# EAGLE design VHN-B (EAGLE 7.1.0)
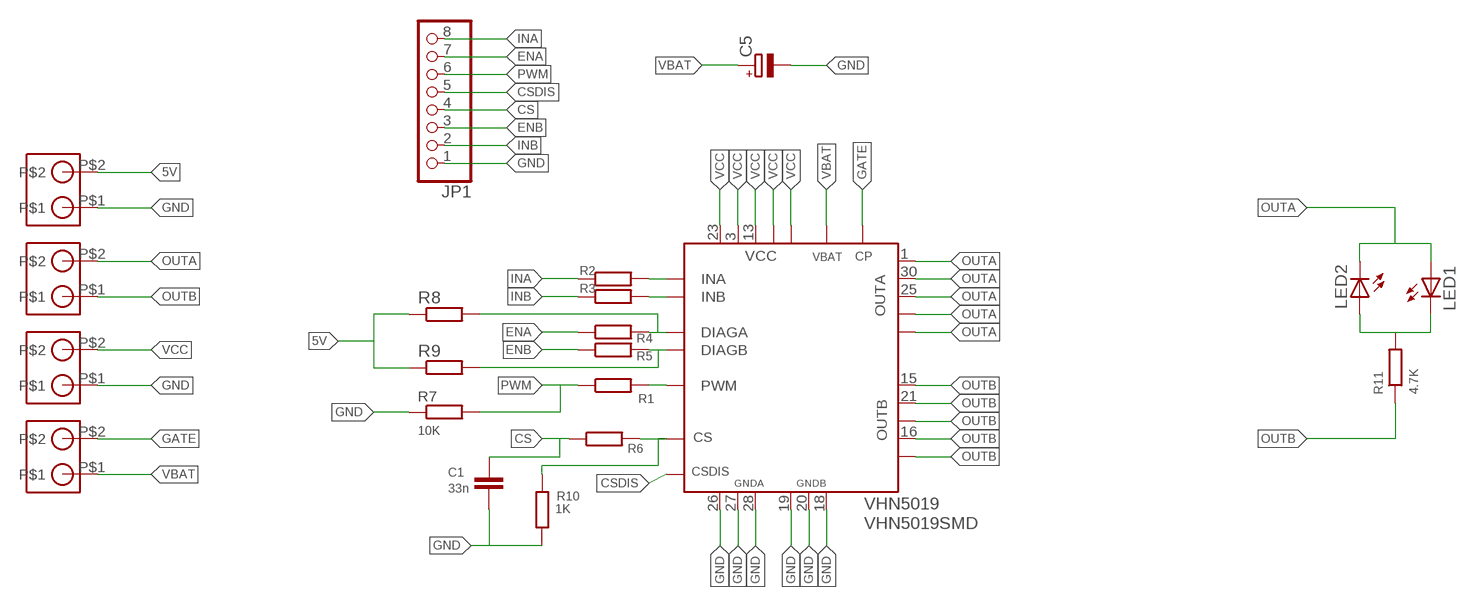
[diagram p0: schematic, sheet 1]

## Parts
C1  33n  C-EUC0402  [C0402]
C5  CPOL-EUE2,5-6E  [E2,5-6E]
JP1  PINHD-1X8  [1X08]
LED1  LEDCHIPLED_0603  [CHIPLED_0603]
LED2  LEDCHIPLED_0603  [CHIPLED_0603]
R1  R-EU_R0402  [R0402]
R2  R-EU_R0402  [R0402]
R3  R-EU_R0402  [R0402]
R4  R-EU_R0402  [R0402]
R5  R-EU_R0402  [R0402]
R6  R-EU_R0402  [R0402]
R7  10K  R-EU_R0402  [R0402]
R8  R-EU_R0402  [R0402]
R9  R-EU_R0402  [R0402]
R10  1K  R-EU_R0402  [R0402]
R11  4.7K  R-EU_R0402  [R0402]
U$1  PBCON  [02P]
U$2  PBCON  [02P]
U$3  PBCON  [02P]
U$4  PBCON  [02P]
VHN5019  VHN5019SMD  [SO-30]

## Nets
5V: R8.1 R9.1 U$4.P$2
CS: C1.1 JP1.4 R6.1
CSDIS: JP1.5 VHN5019.6(CSDIS)
ENA: JP1.7 R4.1
ENB: JP1.3 R5.1
GATE: U$3.P$2 VHN5019.11(CP)
GND: C1.2 C5.- JP1.1 R7.1 R10.1 U$1.P$1 U$4.P$1 VHN5019.18(GNDB) VHN5019.19(GNDB) VHN5019.20(GNDB) VHN5019.26(GNDA) VHN5019.27(GNDA) VHN5019.28(GNDA)
INA: JP1.8 R2.1
INB: JP1.2 R3.1
N$1: R2.2 VHN5019.4(INA)
N$2: R3.2 VHN5019.10(INB)
N$3: R4.2 R8.2 VHN5019.5(DIAGA)
N$4: R5.2 R9.2 VHN5019.9(DIAGB)
N$5: R1.2 VHN5019.7(PWM)
N$6: LED1.C LED2.A R11.2
N$7: R6.2 R10.2 VHN5019.8(CS)
OUTA: LED1.A LED2.C U$2.P$2 VHN5019.1(OUTA) VHN5019.25(OUTA) VHN5019.30(OUTA) VHN5019.OUTA VHN5019.OUTA@1(OUTA)
OUTB: R11.1 U$2.P$1 VHN5019.15(OUTB) VHN5019.16(OUTB) VHN5019.21(OUTB) VHN5019.OUTB VHN5019.OUTB@1(OUTB)
PWM: JP1.6 R1.1 R7.2
VBAT: C5.+ U$3.P$1 VHN5019.12(VBAT)
VCC: U$1.P$2 VHN5019.3(VCC) VHN5019.13(VCC) VHN5019.23(VCC) VHN5019.VCC VHN5019.VCC@1(VCC)

## Library data of the parts
C1 = rcl:C-EU: CAPACITOR, European symbol
C5 = rcl:CPOL-EU: POLARIZED CAPACITOR, European symbol
JP1 = pinhead:PINHD-1X8: PIN HEADER
LED1 LED2 = led:LED: LED OSRAM: - CHIPLED LG R971, LG N971, LY N971, LG Q971, LY Q971, LO R971, LY R971 LH N974, LH R974 LS Q976, LO Q976, LY Q976 LO Q996 - Hyper CHIPLED LW Q18S LB Q993, LB Q99A, LB R99A - SideLED LS A670, LO A670, LY A670, LG A670, LP A670 LB A673, LV A673, LT A673, LW A673 LH A674 LY A675 LS A676, LA A676, LO A676, LY A676, LW A676 LS A679, LY A679, LG A679 - Hyper Micro SIDELED® LS Y876, LA Y876, LO Y876, LY Y876 LT Y87S - SmartLED LW L88C, LW L88S LB L89C, LB L89S, LG L890 LS L89K, LO L89K, LY L89K LS L896, LA L896, LO L896, LY L896 - TOPLED LS T670, LO T670, LY T670, LG T670, LP T670 LSG T670, LSP T670, LSY T670, LOP T670, LYG T670 LG T671, LOG T671, LSG T671 LB T673, LV T673, LT T673, LW T673 LH T674 LS T676, LA T676, LO T676, LY T676, LB T676, LH T676, LSB T676, LW T676 LB T67C, LV T67C, LT T67C, LS T67K, LO T67K, LY T67K, LW E67C LS E67B, LA E67B, LO E67B, LY E67B, LB E67C, LV E67C, LT E67C LW T67C LS T679, LY T679, LG T679 LS T770, LO T770, LY T770, LG T770, LP T770 LB T773, LV T773, LT T773, LW T773 LH T774 LS E675, LA E675, LY E675, LS T675 LS T776, LA T776, LO T776, LY T776, LB T776 LHGB T686 LT T68C, LB T68C - Hyper Mini TOPLED® LB M676 - Mini TOPLED Santana® LG M470 LS M47K, LO M47K, LY M47K Source: http://www.osram.convergy.de LUXEON: - LUMILED® LXK2-PW12-R00, LXK2-PW12-S00, LXK2-PW14-U00, LXK2-PW14-V00 LXK2-PM12-R00, LXK2-PM12-S00, LXK2-PM14-U00 LXK2-PE12-Q00, LXK2-PE12-R00, LXK2-PE12-S00, LXK2-PE14-T00, LXK2-PE14-U00 LXK2-PB12-K00, LXK2-PB12-L00, LXK2-PB12-M00, LXK2-PB14-N00, LXK2-PB14-P00, LXK2-PB14-Q00 LXK2-PR12-L00, LXK2-PR12-M00, LXK2-PR14-Q00, LXK2-PR14-R00 LXK2-PD12-Q00, LXK2-PD12-R00, LXK2-PD12-S00 LXK2-PH12-R00, LXK2-PH12-S00 LXK2-PL12-P00, LXK2-PL12-Q00, LXK2-PL12-R00 Source: www.luxeon.com KINGBRIGHT: KA-3528ASYC Source: www.kingbright.com
R1-R11 = rcl:R-EU_: RESISTOR, European symbol
U$1-U$4 = 00-Custom-pbcon:PBCON
VHN5019 = VHN5019:VHN5019

## Board
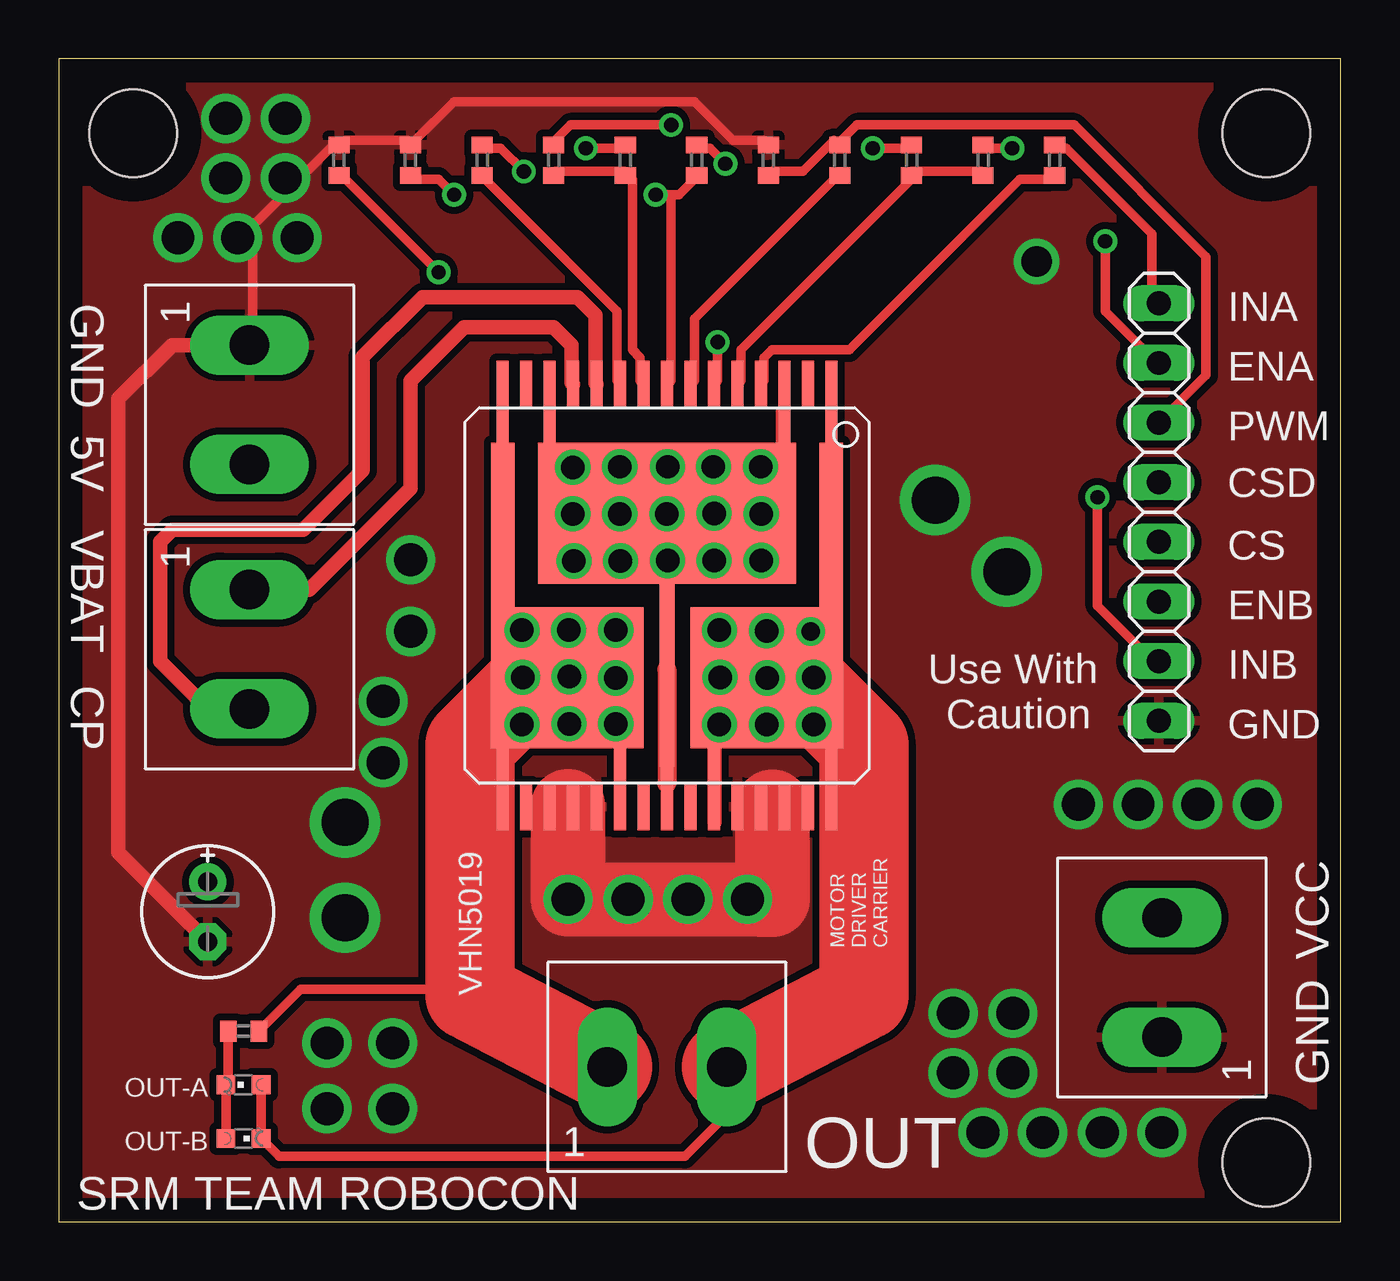
[diagram p1: board, top side]
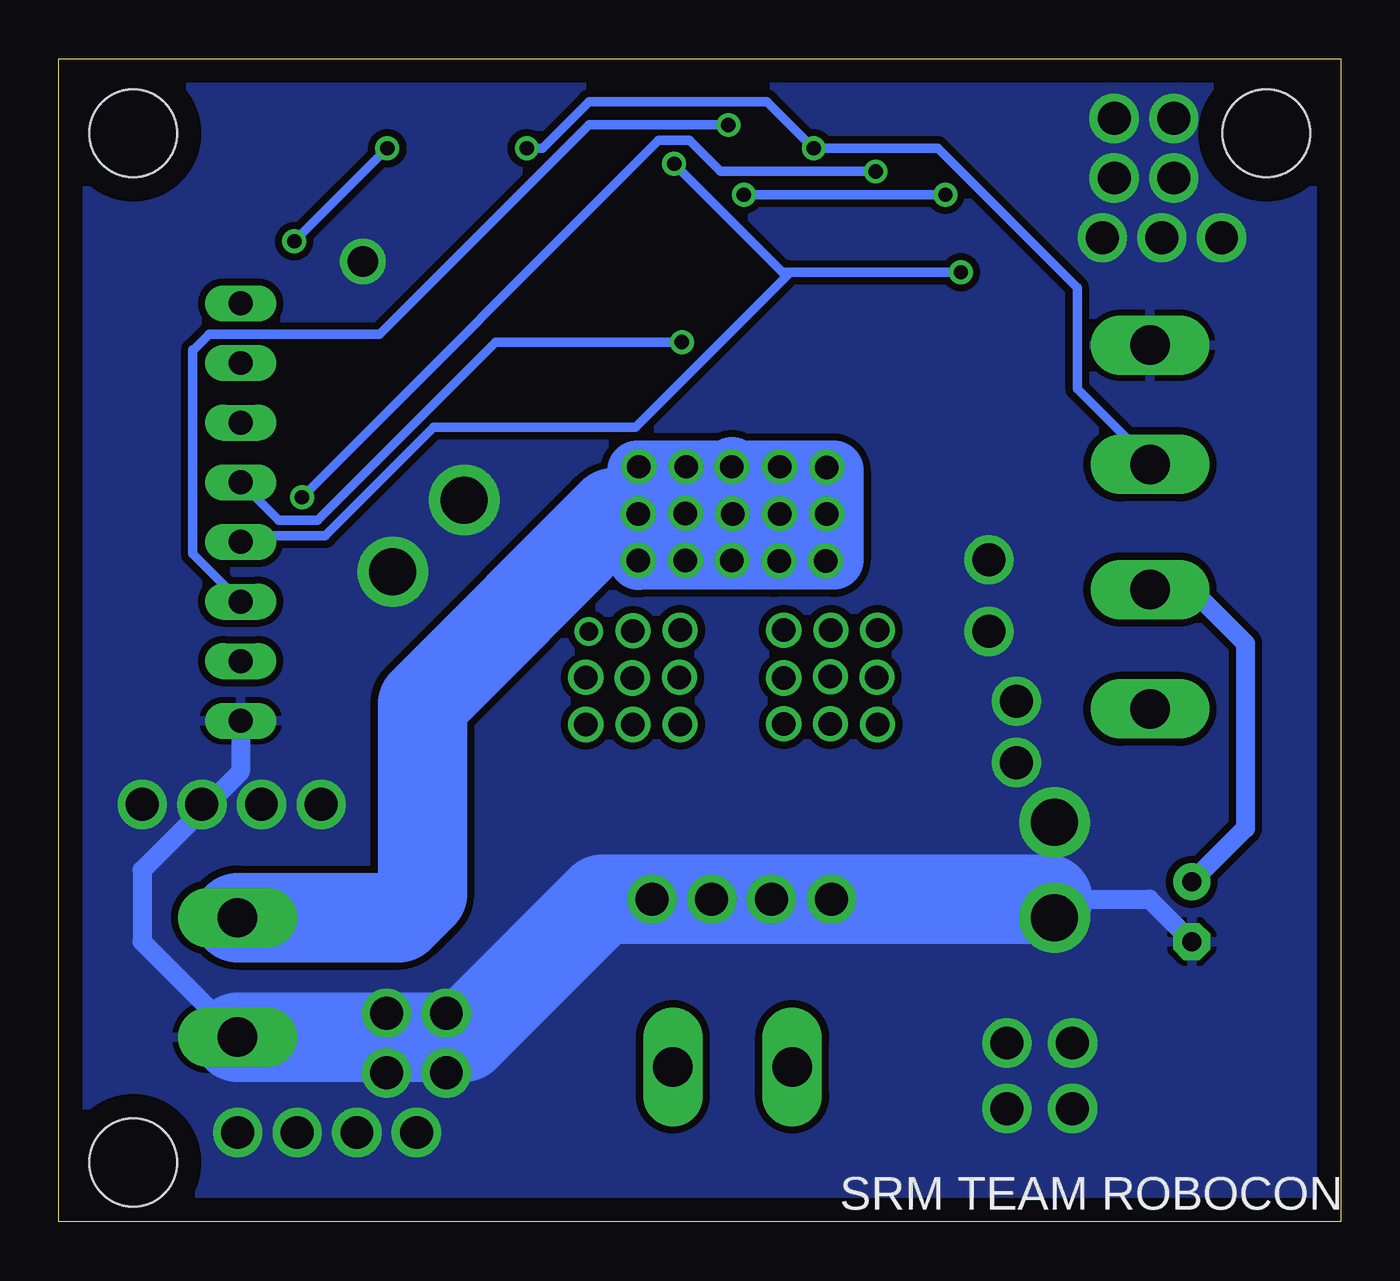
[diagram p2: board, bottom side, seen from below]

Size 54.61 x 49.53 mm. Coordinates in mm from the lower left corner, seen from the top.
Outline: 0,0 54.61,0 54.61,49.53 0,49.53 0,0
Copper layers (1*16): Top 0.035mm / dielectric 1.5mm / Bottom 0.035mm
Design rules "default *": minimum track width 16mil, minimum drill 24mil, track to track 10mil, track to pad 10mil, pad to pad 10mil, via to via 10mil, smd to smd 10mil, copper to edge 40mil, drill to drill 8mil, minimum pad ring 10mil, minimum via ring 8mil, stop-mask expansion 4mil, vias tented up to drill 0mil, thermal gap 10mil
Holes 3.75 mm at 3.17,46.35 51.44,46.35 51.44,2.54

### Footprints (pad centres in the part's own frame; a part is rotated, then mirrored left to right if it is on the bottom)
C0402 = smd 0.7 x 0.9: 1 -0.65,0; 2 0.65,0
E2,5-6E = drill 0.813 pad 1.575: + -1.27,0 | drill 0.813 pad 1.575 octagon: - 1.27,0
1X08 = drill 1.016 long: 1 -8.89,0; 2 -6.35,0; 3 -3.81,0; 4 -1.27,0; 5 1.27,0; 6 3.81,0; 7 6.35,0; 8 8.89,0
CHIPLED_0603 = smd 0.8 x 0.8: A 0,-0.75; C 0,0.75
R0402 = smd 0.7 x 0.9: 1 -0.65,0; 2 0.65,0
02P = drill 1.676 pad 2.54 long: P$1 -2.54,0; P$2 2.54,0
SO-30 = smd 12 x 0.508: 1 -4,7; 15 -4,-7; 16 4,-7; 30 4,7 | smd 2 x 0.508: 2 -9,6; 4 -9,4; 5 -9,3; 6 -9,2; 7 -9,1; 8 -9,0; 9 -9,-1; 10 -9,-2; 11 -9,-3; 12 -9,-4; 14 -9,-6; 17 9,-6; 18 9,-5; 19 9,-4; 20 9,-3; 22 9,-1; 24 9,1; 26 9,3; 27 9,4; 28 9,5; 29 9,6 | smd 4 x 0.508: 3 -8,5; 13 -8,-5; 21 8,-2; 23 8,0; 25 8,2 | smd 6 x 6.5: OUTA 3.5,4.25; OUTB 3.5,-4.25 | smd 7.5 x 1: OUTA@1 -2.755,7; OUTB@1 -2.755,-7 | smd 6 x 11: VCC -3.5,0 | smd 8.3 x 0.65: VCC@1 3.145,0

### Placement (x,y rotation side)
C1  11.94,45.21 90 top
C5  6.35,13.21 270 top
JP1  46.86,30.23 90 top
LED1  7.87,5.84 90 top
LED2  7.87,3.56 270 top
R1  33.27,45.21 270 top
R2  42.42,45.21 270 top
R3  18.03,45.21 270 top
R4  39.37,45.21 270 top
R5  21.08,45.21 270 top
R6  27.18,45.21 270 top
R7  30.23,45.21 270 top
R8  36.32,45.21 270 top
R9  24.13,45.21 270 top
R10  14.99,45.21 270 top
R11  7.87,8.13 180 top
U$1  46.99,10.41 90 top
U$2  25.91,6.6 0 top
U$3  8.13,24.38 270 top
U$4  8.13,34.8 270 top
VHN5019  25.91,26.67 270 top

### Tracks (layer width: path | path; a pad name or v marks a point on that pad's centre or on a via)
5V  (via drill 0.61)
  Top 0.406: v22.45,45.72 24.11,45.72 R9.1 | v34.67,45.72 36.32,45.72 R8.1
  Bottom 0.406: U$4.P$2 8.25,32.51 11.23,35.48 11.23,39.78 17.17,45.72 v22.45,45.72 24.44,47.7 32.03,47.7 34.01,45.72 v34.67,45.72
CS  (via drill 0.61)
  Top 0.406: v16.18,40.44 12.22,44.4 C1.1 | v28.4,45.06 27.74,45.72 27.41,45.72 R6.1
  Bottom 0.406: 23.44,40.44 v16.18,40.44 | 23.44,40.44 30.05,33.83 38.63,33.83 43.26,29.21 46.56,29.21 JP1.4 | v28.4,45.06 23.77,40.44 23.44,40.44
CSDIS  (via drill 0.61)
  Top 0.406: v28.07,37.46 28.07,35.81 VHN5019.6
  Bottom 0.406: v28.07,37.46 35.99,37.46 43.59,29.87 45.24,29.87 JP1.5
ENA  (via drill 0.61)
  Top 0.406: v40.62,45.72 39.62,45.72 R4.1 | v44.58,41.76 44.58,38.79 46.56,36.8 JP1.7
  Bottom 0.406: v44.58,41.76 v40.62,45.72
ENB  (via drill 0.61)
  Top 0.406: v26.09,46.71 21.79,46.71 21.13,46.05 R5.1
  Bottom 0.406: v26.09,46.71 32.03,46.71 40.94,37.79 48.21,37.79 48.87,37.13 48.9,37.13 48.9,28.45 JP1.3
GATE
  Top 0.61: U$3.P$2 6.35,21.84 4.32,23.88 4.32,28.96 4.83,29.46 10.41,29.46 12.95,32 12.95,36.83 15.49,39.37 22.1,39.37 22.86,38.61 22.86,35.72 VHN5019.11
GND  (via drill 1.3, 1.4, 1.4 pad 0.61, 2 pad 0.61)
  Top 0.406: VHN5019.20 21.69,17.7 VHN5019.18 | VHN5019.26 VHN5019.27 30.4,17.67 VHN5019.28 | v26.8,13.74 v21.69,13.74 v24.26,13.74 | R7.1 30.05,46.05 28.73,46.05 27.08,47.7 16.84,47.7 15.19,46.05 R10.1 14.86,46.05 12.22,46.05 C1.2 11.89,45.72 11.56,45.72 8.25,42.42 8.25,37.46 U$4.P$1
  Top 0.61: U$4.P$1 4.83,37.34 2.54,35.05 2.54,15.75 C5.-
  Top 2.54: VHN5019.19 21.69,17.7
  Top 3.175: 21.69,17.7 v21.69,13.74 29.91,13.72 30.4,13.72 30.4,17.67
  Bottom 0.813: 12.47,13.74 8.15,13.74 C5.- | JP1.1 46.86,19.18 51.05,14.99 51.05,11.94 U$1.P$1
  Bottom 2.54: v21.69,13.74 29.87,13.72 29.9,13.74 v29.34,13.74 | 12.47,13.74 12.45,13.72
  Bottom 3.81: 12.47,13.74 v29.34,13.74 31.47,13.74 37.34,7.87 U$1.P$1
  other vias: 11.43,7.62 14.22,4.83 14.22,7.62 11.43,4.83 12.19,17.02 12.19,12.95 13.82,19.56 13.82,22.17 14.99,25.15 14.99,28.19 10.16,41.91 7.62,41.91 5.08,41.91 7.11,44.45 9.65,44.45 9.65,46.99 7.11,46.99 38.1,8.89 40.64,8.89 38.1,6.35 40.64,6.35 39.37,3.81 41.91,3.81 44.45,3.81 46.99,3.81 43.43,17.78 45.97,17.78 48.51,17.78 51.05,17.78 37.34,30.73 40.39,27.69 41.66,40.89
  pour Top (isolate 0.305): 0.25,49.28 54.36,49.28 54.36,0.25 0.25,0.25
  pour Bottom (isolate 0.305): 0.25,49.28 54.36,49.28 54.36,0.25 0.25,0.25
INA
  Top 0.406: R2.1 42.6,45.72 42.93,45.72 46.56,42.09 46.56,39.42 JP1.8
INB  (via drill 0.61)
  Top 0.406: v19.81,44.73 18.82,45.72 18.16,45.72 R3.1 | v44.25,30.86 44.25,26.24 46.56,23.93 JP1.2
  Bottom 0.406: v19.81,44.73 26.42,44.73 27.74,46.05 29.06,46.05 v44.25,30.86
N$1
  Top 0.406: R2.2 42.27,44.4 40.94,44.4 33.68,37.13 30.38,37.13 30.05,36.8 30.05,35.81 VHN5019.4
N$2
  Top 0.406: R3.2 18.16,44.4 23.77,38.79 23.77,35.81 VHN5019.10
N$3
  Top 0.406: R4.2 39.29,44.73 36.32,44.73 R8.2 36.32,44.4 29.06,37.13 29.06,35.81 VHN5019.5
N$4
  Top 0.406: R5.2 21.13,44.73 24.11,44.73 R9.2 24.44,44.4 24.44,37.13 24.77,36.8 24.77,35.81 VHN5019.9
N$5
  Top 0.406: R1.2 33.02,44.4 27.08,38.46 27.08,35.81 VHN5019.7
N$6
  Top 0.406: LED2.A LED1.C 7.22,5.94 R11.2
N$7  (via drill 0.61)
  Top 0.406: v16.84,43.74 16.18,44.4 15.19,44.4 R10.2 | 26.09,43.74 26.42,43.74 27.08,44.4 R6.2 | 26.09,43.74 v25.42,43.74 | 26.09,43.74 26.09,35.81 VHN5019.8
  Bottom 0.406: v25.42,43.74 v16.84,43.74
OUTA  (via drill 0.8, 1)
  Top 0.406: U$2.P$2 28.45,4.57 26.67,2.79 9.39,2.79 LED2.C LED1.A | v32.16,21.18 32.16,21.92 VHN5019.30 | v30.15,21.18 30.15,21.77 31.12,22.73 | v32.16,23.19 31.46,23.19 31.44,23.17 | v28.17,23.19 28.17,25.17 v28.14,25.2 | v28.17,23.19 28.94,23.19 28.96,23.17 | v30.15,25.17 30.15,24.21 30.23,24.13 | v32.03,25.15 32.18,24.71 32.26,24.64 | VHN5019.OUTA v30.18,23.17 | v28.14,21.18 28.17,21.18 v28.17,23.19
  Top 0.61: 31.24,22.61 32.84,22.61 VHN5019.30 | 30.23,24.13 31.75,24.13 32.26,24.64 32.77,25.15 32.77,30.53 VHN5019.1 VHN5019.OUTA@1 | VHN5019.OUTA 28.96,23.17 28.76,23.17 27.94,22.35 27.94,18.64 | 27.94,17.02 27.94,18.64 | 27.94,18.64 VHN5019.25
  Top 3.81: U$2.P$2 34.29,9.65 34.29,20.32 31.44,23.17 VHN5019.OUTA 30.16,24.06 30.23,24.13 30.23,23.62 31.12,22.73 31.24,22.61
OUTB  (via drill 1)
  Top 0.406: VHN5019.OUTB v23.73,23.17 | VHN5019.21 23.91,17.78 23.88,17.78 23.88,23.17 v23.73,23.17 | VHN5019.16 20.38,22.67 | 20.38,22.67 20.38,23.17 19.81,23.17 | 19.81,23.17 19.05,23.17 19.05,25.65 | 19.05,25.65 18.91,25.65 VHN5019.OUTB@1 VHN5019.15 | 17.53,9.65 17.78,9.65 17.78,9.91 10.3,9.91 R11.1 | v19.74,21.18 19.74,22.03 20.38,22.67 | v19.76,23.19 19.79,23.19 19.81,23.17 | VHN5019.OUTB 21.66,21.29 v21.74,21.21 | v23.72,21.21 v23.72,23.17 v23.73,23.17 | v23.72,25.2 v21.72,25.2 | v21.72,25.2 v19.74,25.2 19.51,25.2 19.05,25.65 | v21.72,25.2 21.72,23.24 v21.74,23.22 21.7,23.17 VHN5019.OUTB
  Top 3.81: VHN5019.OUTB 20.38,23.17 17.53,20.32 17.53,9.65 U$2.P$1
PWM
  Top 0.406: R7.2 30.38,44.73 31.7,44.73 33.02,46.05 R1.1 33.35,46.05 34.01,46.71 43.26,46.71 48.87,41.1 48.87,36.04 JP1.6
VBAT
  Top 0.61: U$3.P$1 10.67,26.92 14.99,31.24 14.99,35.81 17.27,38.1 21.08,38.1 21.84,37.34 21.84,35.73 VHN5019.12
  Bottom 0.813: U$3.P$1 6.35,26.92 4.06,24.64 4.06,16.76 C5.+
VCC  (via drill 1)
  Top 0.406: 30.74,30.19 30.74,32.76 30.73,32.77 30.73,34.5 VHN5019.3 | 30.73,32.51 30.73,30.45 30.99,30.2 | 30.99,30.2 | 30.99,30.2 30.23,30.2 30.22,30.19 | v29.92,28.17 v27.91,28.17 | v25.93,28.17 25.91,28.17 | 25.91,28.17 25.91,28.45 | 25.91,28.17 VHN5019.VCC@1 | v21.89,32.13 20.91,32 VHN5019.13 | v25.91,30.15 26.09,30.2 VHN5019.VCC
  Top 0.813: VHN5019.VCC@1 VHN5019.23 | 29.96,30.19 27.93,30.19 v27.91,30.18 | 30.22,30.19 29.96,30.19 | 29.96,30.19 v29.92,30.15 | v27.91,28.17 v25.93,28.17 | v23.9,30.15 23.9,28.17 v23.93,28.14 23.88,28.19 21.89,28.19 | v21.89,30.15 21.89,28.19 | 21.89,28.19 v21.95,28.14
  Top 1.27: v29.92,28.17 30.23,32 30.73,32.51 | VHN5019.VCC 28.65,30.17 30.73,32.26 30.73,30.2 30.74,30.19
  Top 1.676: 25.91,31.5 v25.93,32.16
  Top 2.54: VHN5019.VCC 25.91,31.5
  Bottom 0.406: 21.59,32 v21.89,32.13
  Bottom 0.813: v21.89,32.13 23.88,32.13 v23.9,32.16 | 26.16,32 27.74,32 v27.89,32.16 | 29.97,32 29.97,32.08 v29.9,32.16 | 24.12,28.19 23.97,28.19 v23.93,28.14
  Bottom 1.27: 24.12,28.19 24.12,29.21 23.88,29.46
  Bottom 2.54: v25.93,32.16 26.16,32 | 26.16,32 29.97,32 | 26.16,32 21.59,32 21.59,28.19 24.12,28.19 v29.92,28.17
  Bottom 3.81: U$1.P$2 40.13,12.95 39.12,13.97 39.12,22.07 30.99,30.2 22.83,30.2 22.35,29.72 23.62,29.72 23.88,29.46 24.13,29.72

### Text on the board
tPlace: GND | INA | ENA | 5V | PWM | CSD | VBAT | CS | ENB | CP | INB | Use With / Caution | GND | MOTOR / DRIVER / CARRIER | VCC | VHN5019 | GND | OUT-A | OUT-B | OUT | SRM TEAM ROBOCON
bPlace: SRM TEAM ROBOCON